# EAGLE design NEO_Board (EAGLE 7.6.0)
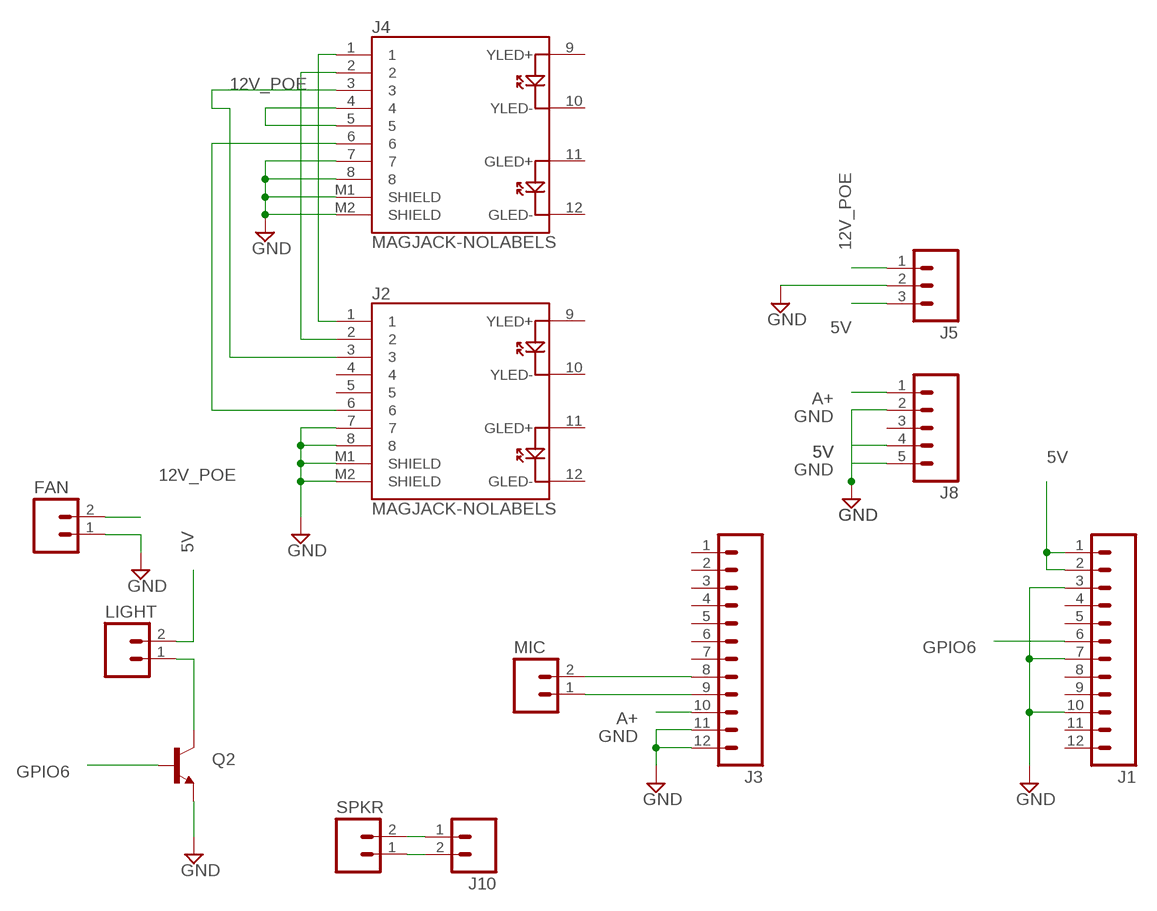
[diagram p0: schematic, sheet 1]

## Parts
FAN  M02PTH  [1X02]
J1  M12PTH  [1X12]
J2  MAGJACK-NOLABELS  [MAGJACK]
J3  M12PTH  [1X12]
J4  MAGJACK-NOLABELS  [MAGJACK]
J5  M03PTH  [1X03]
J8  M05PTH  [1X05]
J10  M023.5MM  [SCREWTERMINAL-3.5MM-2]
LIGHT  M02PTH  [1X02]
MIC  M02PTH  [1X02]
Q2  TRANSISTOR_NPNP2N2222A  [TO-92]
SPKR  M02PTH  [1X02]

## Nets
5V: J1.1 J1.2 J5.3 J8.4 LIGHT.2
12V_POE: FAN.2 J4.4 J4.5 J5.1
A+: J3.10 J8.1
GND: FAN.1 J1.3 J1.7 J1.10 J2.7 J2.8 J2.M1(SHIELD) J2.M2(SHIELD) J3.11 J3.12 J4.7 J4.8 J4.M1(SHIELD) J4.M2(SHIELD) J5.2 J8.2 J8.5 Q2.3(E)
GPIO6: J1.6 Q2.2(B)
MICN: J3.9 MIC.1
MICP: J3.8 MIC.2
N$1: J2.1 J4.1
N$2: J2.2 J4.2
N$3: J2.3 J4.3
N$4: J2.6 J4.6
N$5: LIGHT.1 Q2.1(C)
N$6: J10.1 SPKR.2
N$7: J10.2 SPKR.1
Unconnected: J1.4 J1.5 J1.8 J1.9 J1.11 J1.12 J2.4 J2.5 J2.9(YLED+) J2.10(YLED-) J2.11(GLED+) J2.12(GLED-) J3.1 J3.2 J3.3 J3.4 J3.5 J3.6 J3.7 J4.9(YLED+) J4.10(YLED-) J4.11(GLED+) J4.12(GLED-) J8.3

## Library data of the parts
FAN LIGHT MIC SPKR = SparkFun-Connectors:M02: Standard 2-pin 0.1" header. Use with - straight break away headers ( PRT-00116) - right angle break away headers (PRT-00553) - swiss pins (PRT-00743) - machine pins (PRT-00117) - female headers (PRT-00115) Molex polarized connector foot print use with: PRT-08233 with associated crimp pins and housings. 2.54_SCREWTERM for use with PRT-10571. 3.5mm Screw Terminal footprints for PRT-08084 5mm Screw Terminal footprints for use with PRT-08432
J1 J3 = SparkFun-Connectors:M12: Header 12 Standard 12-pin 0.1" header. Use with straight break away headers (SKU : PRT-00116), right angle break away headers (PRT-00553), swiss pins (PRT-00743), machine pins (PRT-00117), and female headers (PRT-00115).
J2 J4 = SparkFun-Connectors:MAGJACK-NOLABELS; PROD_ID: CONN-09556
J5 = SparkFun-Connectors:M03: Header 3 Standard 3-pin 0.1" header. Use with straight break away headers (SKU : PRT-00116), right angle break away headers (PRT-00553), swiss pins (PRT-00743), machine pins (PRT-00117), and female headers (PRT-00115). Molex polarized connector foot print use with SKU : PRT-08232 with associated crimp pins and housings.
J8 = SparkFun-Connectors:M05: Header 5 Standard 5-pin 0.1" header. Use with straight break away headers (SKU : PRT-00116), right angle break away headers (PRT-00553), swiss pins (PRT-00743), machine pins (PRT-00117), and female headers (PRT-00115). Molex polarized connector foot print use with SKU : PRT-08230 with associated crimp pins and housings.
J10 = SparkFun-Connectors:M02: Standard 2-pin 0.1" header. Use with - straight break away headers ( PRT-00116) - right angle break away headers (PRT-00553) - swiss pins (PRT-00743) - machine pins (PRT-00117) - female headers (PRT-00115) Molex polarized connector foot print use with: PRT-08233 with associated crimp pins and housings. 2.54_SCREWTERM for use with PRT-10571. 3.5mm Screw Terminal footprints for PRT-08084 5mm Screw Terminal footprints for use with PRT-08432; PROD_ID: CONN-08399
Q2 = SparkFun-DiscreteSemi:TRANSISTOR_NPN: Generic NPN BJT MMBT2222A - TRANS-08049 (SOT-23, 1A 40V) MPSA42 - TRANS-09116 (SOT-23, 500mA 300V) MMBT5088LT1G - TRANS-11160 (SOT-23, 50 mA 30V) BC547 - COM-08928 <http://www.sparkfun.com/products/8928> (TO-92 45V 100mA) (1.Collector 2.Base 3.Emitter) 2N3904 - COM-00521 <http://www.sparkfun.com/products/521> (TO-92 40V 200mA) (1.Emitter 2.Base 3.Collector) P2N2222A - COM-12852 <http://www.sparkfun.com/products/12852> (TO-92 40V 600mA) (1.Collector 2.Base 3.Emitter); PROD_ID: TRANS-09536

## Board
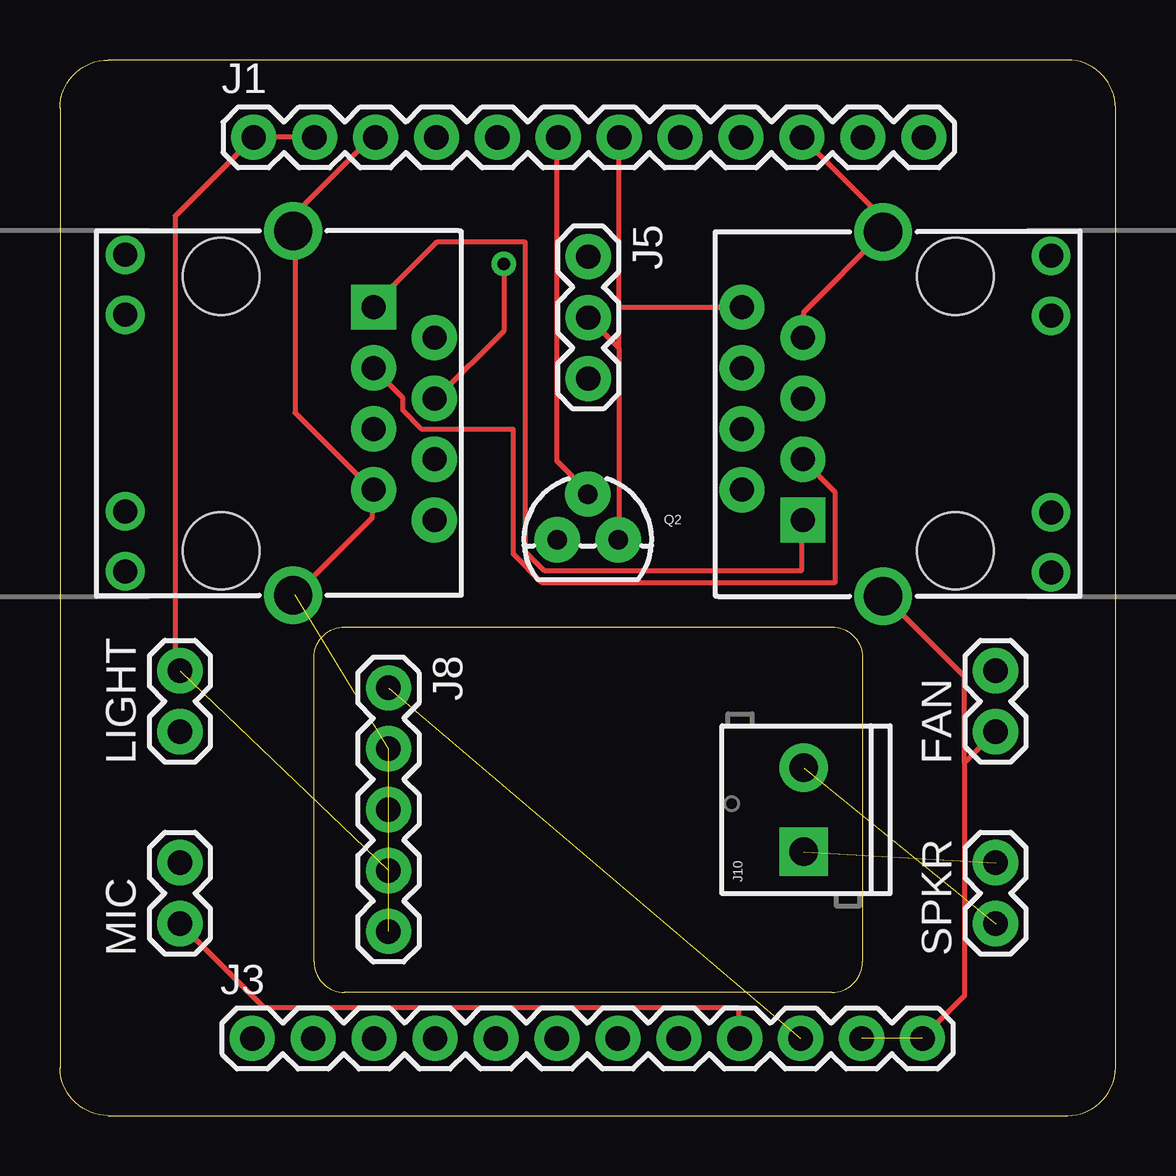
[diagram p1: board, top side]
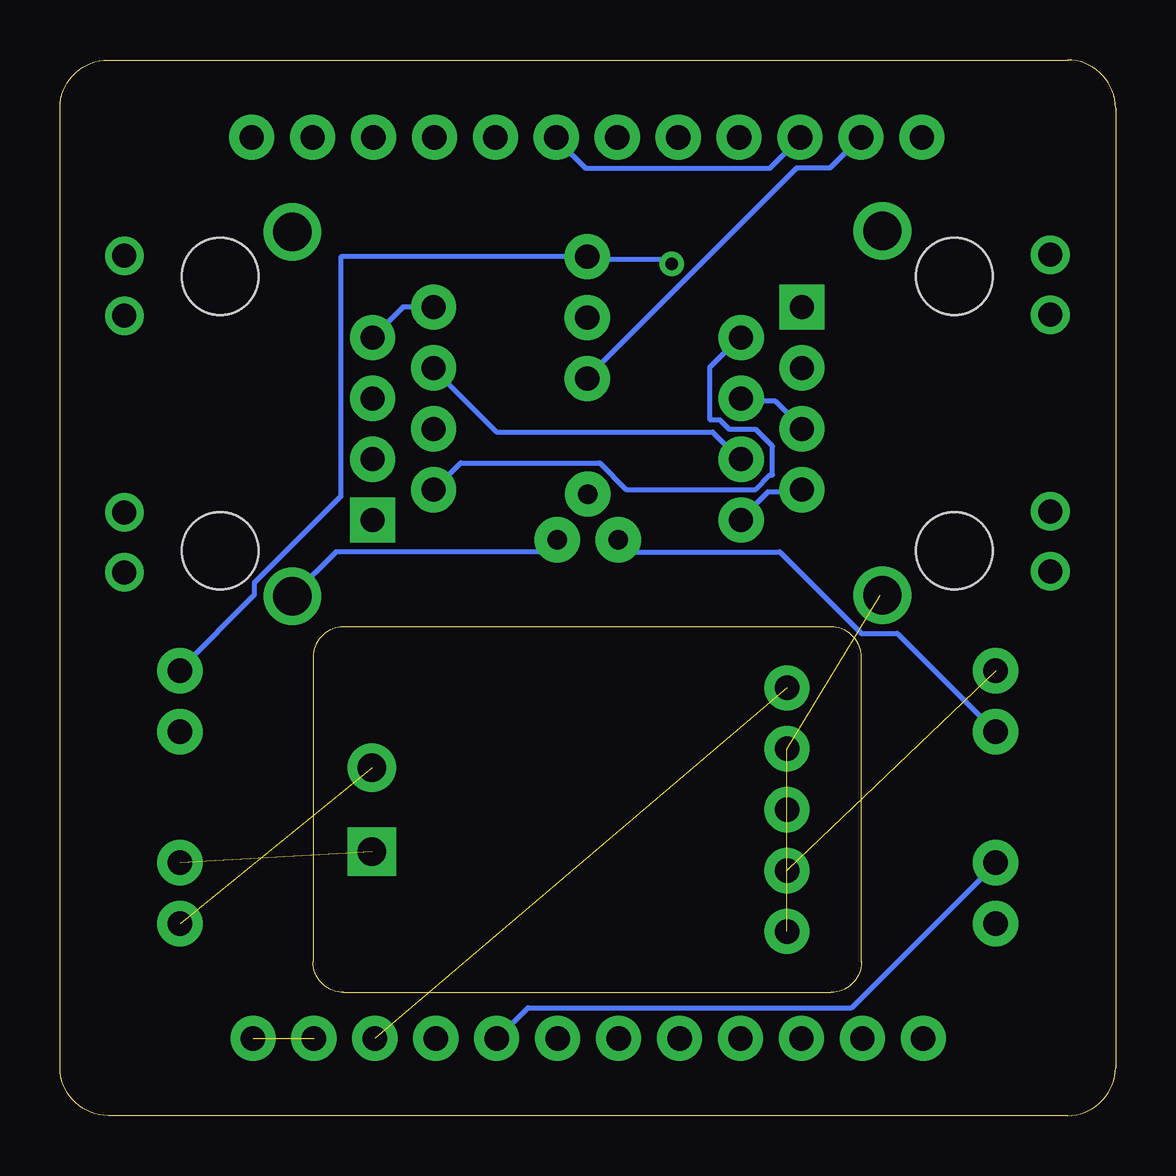
[diagram p2: board, bottom side, seen from below]

Size 44 x 44 mm. Coordinates in mm from the lower left corner, seen from the top.
Outline: 11.86,20.37 32.18,20.37 arc-90 33.45,19.1 33.45,6.4 arc-90 32.18,5.13 11.86,5.13 arc-90 10.59,6.4 10.59,19.1 arc-90 11.86,20.37
Outline: 2,0 42,0 arc90 44,2 44,42 arc90 42,44 2,44 arc90 0,42 0,2 arc90 2,0
Copper layers (1*16): Top 0.035mm / dielectric 1.5mm / Bottom 0.035mm
Design rules "SparkFun": minimum track width 8mil, minimum drill 20mil, track to track 8mil, track to pad 8mil, pad to pad 8mil, via to via 8mil, smd to smd 8mil, copper to edge 8mil, drill to drill 8mil, minimum pad ring 12mil, minimum via ring 10mil, stop-mask expansion 4mil, vias tented up to drill 20mil, thermal gap 10mil

### Footprints (pad centres in the part's own frame; a part is rotated, then mirrored left to right if it is on the bottom)
1X02 = drill 1.016 pad 1.88: 1 0,0; 2 2.54,0
1X12 = drill 1.016 pad 1.88: 1 0,0; 2 2.54,0; 3 5.08,0; 4 7.62,0; 5 10.16,0; 6 12.7,0; 7 15.24,0; 8 17.78,0; 9 20.32,0; 10 22.86,0; 11 25.4,0; 12 27.94,0
MAGJACK = drill 1 pad 1.88 square: 1 3.175,17.445 | drill 1 pad 1.88: 2 4.445,19.985; 3 5.715,17.445; 4 6.985,19.985; 5 8.255,17.445; 6 9.525,19.985; 7 10.795,17.445; 8 12.065,19.985 | drill 1 pad 1.27: 9 1,7.1; 10 3.5,7.1; 11 11.7,7.1; 12 14.2,7.1 | drill 1.6 pad 2.184: M1 0,14.1; M2 15.2,14.1 | hole 3.2: 1.905,11.095; 13.335,11.095
1X03 = drill 1.016 pad 1.88: 1 0,0; 2 2.54,0; 3 5.08,0
1X05 = drill 1.016 pad 1.88: 1 0,0; 2 2.54,0; 3 5.08,0; 4 7.62,0; 5 10.16,0
SCREWTERMINAL-3.5MM-2 = drill 1.2 pad 2.032 square: 1 0,0 | drill 1.2 pad 2.032: 2 3.5,0
TO-92 = drill 0.813 pad 1.88: 1 -1.27,0; 2 0,1.905; 3 1.27,0

### Placement (x,y rotation side)
FAN  39,16 90 top
J1  8.07,40.78 0 top
J2  48.42,21.64 90 top
J3  8.01,3.21 0 top
J4  -4.38,36.88 270 top
J5  22.02,35.8 270 top
J8  13.69,17.83 270 top
J10  31,11 90 top
LIGHT  5,16 90 top
MIC  5,8 90 top
Q2  22,24 0 top
SPKR  39,8 90 top

### Tracks (layer width: path | path; a pad name or v marks a point on that pad's centre or on a via)
5V  (1 unrouted)
  Top 0.203: LIGHT.2 5,18.6 4.8,18.8 4.8,37.5 8,40.7 J1.1 8.1,40.8 10.6,40.8 J1.2
  Bottom 0.203: J5.3 22,30.8 13.3,39.5 11.9,39.5 10.7,40.7 J1.2
12V_POE  (via drill 0.51)
  Top 0.203: v18.5,35.5 18.5,32.7 15.7,29.9 J4.4
  Bottom 0.203: J4.5 13.1,28.7 14.2,29.8 15.6,29.8 J4.4 | FAN.2 39,18.6 35.9,21.7 35.9,22.2 32.3,25.8 32.3,35.8 J5.1 22,35.7 18.7,35.7 v18.5,35.5
A+  (1 unrouted)
GND  (3 unrouted)
  Top 0.203: 12.98,40.74 J1.3 12.9,40.7 9.8,37.6 9.8,36.9 J4.M1 9.8,36.8 9.8,29.3 13,26.1 J4.7 13,26 13,24.9 9.8,21.7 J4.M2 | 37.7,14.7 37.7,5 36,3.3 J3.12 | FAN.1 37.7,14.7 | 37.7,14.7 37.7,18.3 34.4,21.6 J2.M1 | J1.10 31,40.7 34.3,37.4 34.3,36.9 J2.M2 34.3,36.8 31,33.5 31,32.5 J2.7 | 23.3,32 23.3,24 Q2.3 | 23.3,32 22.1,33.2 J5.2 | 23.3,32 23.3,33.7 | 23.3,33.7 23.3,40.7 J1.7 | 23.3,33.7 28.4,33.7 J2.8
  Bottom 0.203: J4.8 15.6,24.9 14.5,26 13.1,26 J4.7 | J2.7 30.9,32.5 29.7,33.7 28.5,33.7 J2.8 | J1.3 13.2,40.7 14.4,39.5 22.1,39.5 23.3,40.7 J1.7 | J2.M1 34.3,21.7 32.5,23.5 23.8,23.5 23.3,24 Q2.3
GPIO6
  Top 0.203: Q2.2 22,26 20.7,27.3 20.7,40.7 J1.6
MICN
  Top 0.203: MIC.1 8.5,4.5 28.3,4.5 28.3,3.3 J3.9
MICP
  Bottom 0.203: MIC.2 5,10.5 11,4.5 24.5,4.5 25.7,3.3 J3.8
N$1
  Top 0.203: J4.1 13.1,33.8 15.7,36.4 19.4,36.4 19.4,23.5 20.2,22.7 30.9,22.7 30.9,24.8 J2.1
N$2
  Bottom 0.203: J4.2 15.7,32.4 16.9,31.2 16.9,29 16.5,29 16.1,28.6 15,28.6 14.3,27.9 14.3,26.7 14.4,26.7 15,26.1 20.4,26.1 21.5,27.2 27.3,27.2 28.4,26.1 J2.2
N$3
  Top 0.203: J4.3 13.1,31.1 14.3,29.9 14.3,29.4 15.1,28.6 18.9,28.6 18.9,23.4 20.1,22.2 32.3,22.2 32.3,26 31,27.3 J2.3
N$4
  Bottom 0.203: J4.6 15.7,27.4 16.8,28.5 25.8,28.5 28.4,31.1 J2.6
N$5
  Bottom 0.203: LIGHT.1 9.1,20.1 10.6,20.1 14,23.5 20.2,23.5 20.7,24 Q2.1
N$6  (1 unrouted)
N$7  (1 unrouted)